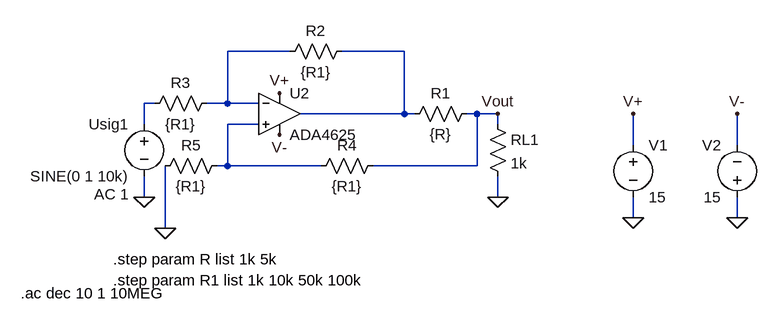
[diagram p0: schematic meros 3o D).asc]
meros 3o D).asc, the LTspice schematic file:
Version 4
SHEET 1 880 680
WIRE -48 0 -144 0
WIRE 128 0 32 0
WIRE -256 80 -272 80
WIRE -144 80 -144 0
WIRE -144 80 -176 80
WIRE -96 80 -144 80
WIRE 128 96 128 0
WIRE 128 96 -32 96
WIRE 144 96 128 96
WIRE 240 96 224 96
WIRE 272 96 240 96
WIRE -272 112 -272 80
WIRE -96 112 -144 112
WIRE 272 112 272 96
WIRE 480 144 480 96
WIRE 640 144 640 96
WIRE -144 176 -144 112
WIRE -144 176 -160 176
WIRE 0 176 -144 176
WIRE 240 176 240 96
WIRE 240 176 80 176
WIRE -272 224 -272 192
WIRE 272 224 272 192
WIRE 480 256 480 224
WIRE 640 256 640 224
WIRE -240 272 -240 176
FLAG -272 224 0
FLAG 272 224 0
FLAG -240 272 0
FLAG 480 256 0
FLAG 640 256 0
FLAG 480 96 V+
FLAG -64 64 V+
FLAG 640 96 V-
FLAG -64 128 V-
FLAG 272 96 Vout
SYMBOL res 240 80 R90
WINDOW 0 0 56 VBottom 2
WINDOW 3 32 56 VTop 2
SYMATTR InstName R1
SYMATTR Value {R}
SYMBOL res 48 -16 R90
WINDOW 0 0 56 VBottom 2
WINDOW 3 32 56 VTop 2
SYMATTR InstName R2
SYMATTR Value {R1}
SYMBOL res -160 64 R90
WINDOW 0 0 56 VBottom 2
WINDOW 3 32 56 VTop 2
SYMATTR InstName R3
SYMATTR Value {R1}
SYMBOL res 256 96 R0
SYMATTR InstName RL1
SYMATTR Value 1k
SYMBOL res 96 160 R90
WINDOW 0 0 56 VBottom 2
WINDOW 3 32 56 VTop 2
SYMATTR InstName R4
SYMATTR Value {R1}
SYMBOL res -144 160 R90
WINDOW 0 0 56 VBottom 2
WINDOW 3 32 56 VTop 2
SYMATTR InstName R5
SYMATTR Value {R1}
SYMBOL voltage -272 96 M0
WINDOW 123 24 124 Left 2
WINDOW 39 0 0 Left 0
SYMATTR Value2 AC 1
SYMATTR InstName Usig1
SYMATTR Value SINE(0 1 10k)
SYMBOL voltage 480 128 R0
WINDOW 123 0 0 Left 0
WINDOW 39 0 0 Left 0
SYMATTR InstName V1
SYMATTR Value 15
SYMBOL voltage 640 240 R180
WINDOW 0 24 96 Left 2
WINDOW 3 24 16 Left 2
WINDOW 123 0 0 Left 0
WINDOW 39 0 0 Left 0
SYMATTR InstName V2
SYMATTR Value 15
SYMBOL OpAmps\\ADA4625 -64 32 R0
SYMATTR InstName U2
TEXT -320 320 Left 2 !.step param R list 1k 5k
TEXT -320 352 Left 2 !.step param R1 list 1k 10k 50k 100k
TEXT -462 372 Left 2 !.ac dec 10 1 10MEG

The netlist it stands for:
* meros 3o D).asc
R1 Vout N002 {R}
R2 N002 N001 {R1}
R3 N001 N003 {R1}
RL1 Vout 0 1k
R4 Vout N004 {R1}
R5 N004 0 {R1}
V§Usig1 N003 0 SINE(0 1 10k) AC 1
V1 V+ 0 15
V2 0 V- 15
XU2 N004 N001 V+ V- N002 ADA4625  ; pins In+ In- V+ V- OUT
.step param R list 1k 5k
.step param R1 list 1k 10k 50k 100k
.ac dec 10 1 10MEG
.backanno
.end